# Altium schematic sheet Optokoppleradapter_Spannungsmessung_V1_2.SchDoc
size 255 x 126 mm
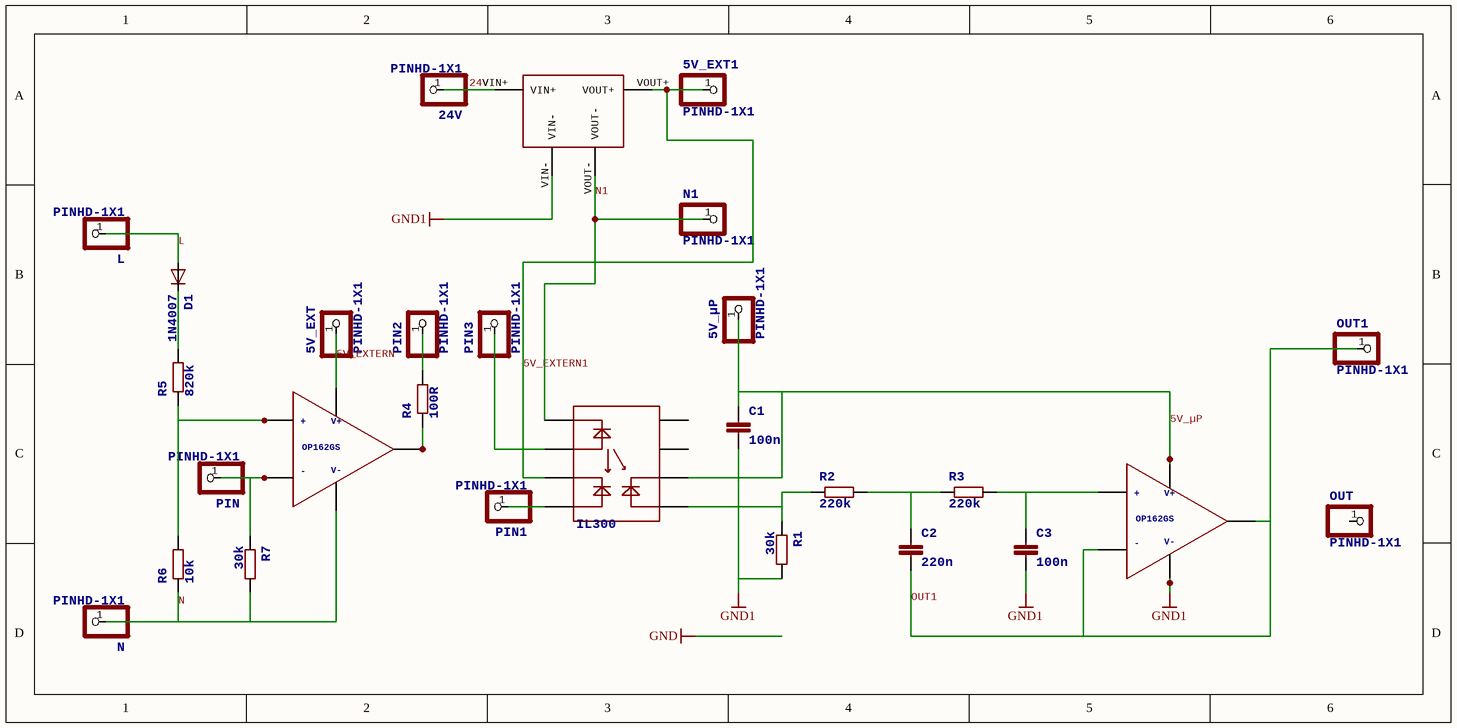
[diagram p0: Optokoppleradapter_Spannungsmessung_V1_2.SchDoc]

## Parts
5V_EXT  PINHD-1X1  [1X01]
5V_EXT1  PINHD-1X1  [1X01]
5V_µP  PINHD-1X1  [1X01]
24V  PINHD-1X1  [1X01]
C1  100n  [C0805]
C2  220n  [C0805]
C3  100n  [C0805]
D1  1N4007  [DO35-7]
L  PINHD-1X1  [1X01]
N  PINHD-1X1  [1X01]
N1  PINHD-1X1  [1X01]
OUT  PINHD-1X1  [1X01]
OUT1  PINHD-1X1  [1X01]
PIN  PINHD-1X1  [1X01]
PIN1  PINHD-1X1  [1X01]
PIN2  PINHD-1X1  [1X01]
PIN3  PINHD-1X1  [1X01]
R1  30k  [R0805]
R2  220k  [R0805]
R3  220k  [R0805]
R4  100R  [R0805]
R5  820k  [0207/7]
R6  10k  [0207/7]
R7  30k  [0207/7]
U$1  IL300  [DIP8]
U$2  OP162GS  [SOIC_N]
U$3  OP162GS  [SOIC_N]
U$4  RECOM_RO-2405S  [4PIN_SIP]  (value not drawn)

## Nets
GND1: C1.2 C3.2 R1.2 U$3.P$4(V-) U$4.VIN-
5V_EXTERN: 5V_EXT.1 U$2.P$7(V+)
5V_EXTERN1: 5V_EXT1.1 U$1.P$3 U$4.VOUT+
5V_µP: 5V_µP.1 C1.1 U$1.P$6 U$3.P$7(V+)
24V: 24V.1 U$4.VIN+
L: D1.A L.1
N: N.1 R6.1 R7.2 U$2.P$4(V-)
N1: N1.1 U$1.P$1 U$4.VOUT-
OUT1: C2.2 OUT1.1 U$3.P$2(-) U$3.P$6(OUT)
NetC2_1: C2.1 R2.2 R3.1
NetC3_1: C3.1 R3.2 U$3.P$3(+)
NetD1_C: D1.C R5.2
NetPIN1_1: PIN1.1 U$1.P$4
NetPIN2_1: PIN2.1 R4.2
NetPIN3_1: PIN3.1 U$1.P$2
NetPIN_1: PIN.1 R7.1 U$2.P$2(-)
NetR1_1: R1.1 R2.1 U$1.P$5
NetR4_1: R4.1 U$2.P$6(OUT)
NetR5_1: R5.1 R6.2 U$2.P$3(+)

Not connected (* = marked no-connect by the designer): OUT 1; U$1 P$7 P$8

## Library data of the parts
5V_EXT 5V_EXT1 5V_µP 24V L N N1 OUT OUT1 PIN PIN1-PIN3 = PINHD-1X1: <b>PIN HEADER</b>
C1-C3 = C-EUC0805: <B>CAPACITOR</B>, European symbol
D1 = 1N4148DO35-7: <B>DIODE</B><p> / high speed (Philips)
R1-R4 = R-EU_R0805: <B>RESISTOR</B>, European symbol
R5-R7 = R-EU_0207/7: <B>RESISTOR</B>, European symbol
U$1 = IL300: IL300: IL300
U$2 U$3 = OP162GS: +: +; -: -; OP162GS: OP162GS; V+: V+; V-: V-